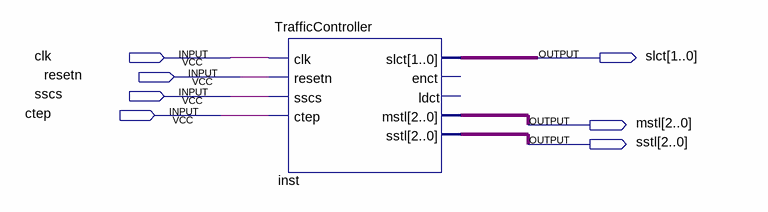
[diagram p0: schematic sheet]
// Quartus schematic testBench.bdf as structural Verilog: 1 symbols, 7 pins
module testBench (
  input  clk,
  input  resetn,
  input  sscs,
  input  ctep,
  output [1:0] slct,
  output [2:0] mstl,
  output [2:0] sstl
);

  TrafficController inst (
    .clk(clk), .resetn(resetn), .sscs(sscs), .ctep(ctep), .slct(slct), .mstl(mstl), .sstl(sstl));  // open: enct, ldct
endmodule
